# Altium schematic sheet Voltage Sensing.SchDoc
size A4
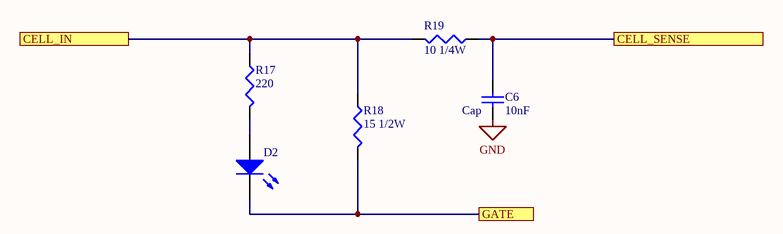
[diagram p0: Voltage Sensing.SchDoc]

## Parts
C6  Cap  value 10nF  [0603 - Capacitor]
D2  LED2  [DIOC1608X06N]  (value not drawn)
R17  value 220  [0805 - Resistor]  (hidden comment: Res3)
R18  value 15 1/2W  [14-1210]  (hidden comment: Res3)
R19  value 10 1/4W  [0805 - Resistor]  (hidden comment: Res3)

## Ports
CELL_IN, CELL_SENSE, GATE

## Nets
GND: C6.1
CELL_IN: R17.1 R18.1 R19.2 ; port CELL_IN
CELL_SENSE: C6.2 R19.1 ; port CELL_SENSE
GATE: D2.2(K) R18.2 ; port GATE
NetD2_1: D2.1(A) R17.2

## Library data of the parts
C6 = Cap: Capacitor; Published: 8-Jun-2000; LatestRevisionDate: 17-Jul-2002; LatestRevisionNote: Re-released for DXP Platform.; PackageReference: RAD-0.3; Publisher: Altium Limited; PackageDescription: Radial Cap, Thru-Hole; 2 Leads; 0.3 in Pin Spacing
D2 = LED2: Typical RED, GREEN, YELLOW, AMBER GaAs LED; Published: 8-Jun-2000; LatestRevisionDate: 17-Jul-2002; LatestRevisionNote: Re-released for DXP Platform.; PackageVersion: Feb-2002; PackageReference: 3.2X1.6X1.1; Publisher: Altium Limited; PackageDescription: SM LED; 2 Flat Leads
R17-R19 = Res3: Resistor; Published: 8-Jun-2000; LatestRevisionDate: 29-May-2009; LatestRevisionNote: IPC-7351 Footprint Added.; PackageReference: J1-0603; Publisher: Altium Limited; PackageDescription: Chip Resistor